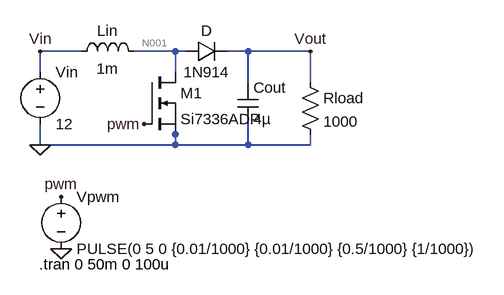
[diagram p0: schematic Buck-Converter.asc]
Buck-Converter.asc, the LTspice schematic file:
Version 4
SHEET 1 916 680
WIRE 128 96 64 96
WIRE 272 96 208 96
WIRE 288 96 272 96
WIRE 384 96 352 96
WIRE 480 96 384 96
WIRE 64 128 64 96
WIRE 272 128 272 96
WIRE 384 144 384 96
WIRE 480 144 480 96
WIRE 272 224 272 208
WIRE 64 240 64 208
WIRE 272 240 272 224
WIRE 272 240 64 240
WIRE 384 240 384 208
WIRE 384 240 272 240
WIRE 480 240 480 224
WIRE 480 240 384 240
FLAG 64 240 0
FLAG 96 400 0
FLAG 96 320 pwm
FLAG 480 96 Vout
FLAG 64 96 Vin
FLAG 224 208 pwm
SYMBOL voltage 64 112 R0
WINDOW 123 0 0 Left 0
WINDOW 39 0 0 Left 0
SYMATTR InstName Vin
SYMATTR Value 12
SYMBOL ind 112 112 R270
WINDOW 0 32 56 VTop 2
WINDOW 3 5 56 VBottom 2
SYMATTR InstName Lin
SYMATTR Value 1m
SYMATTR SpiceLine Rpar=1
SYMBOL cap 368 144 R0
SYMATTR InstName Cout
SYMATTR Value 4µ
SYMATTR SpiceLine Rser=1
SYMBOL res 464 128 R0
SYMATTR InstName Rload
SYMATTR Value 1000
SYMBOL voltage 96 304 R0
WINDOW 123 0 0 Left 0
WINDOW 39 0 0 Left 0
SYMATTR InstName Vpwm
SYMATTR Value PULSE(0 5 0 {0.01/1000} {0.01/1000} {0.5/1000} {1/1000})
SYMBOL nmos 224 128 R0
SYMATTR InstName M1
SYMATTR Value Si7336ADP
SYMBOL diode 288 112 R270
WINDOW 0 32 32 VTop 2
WINDOW 3 0 32 VBottom 2
SYMATTR InstName D
SYMATTR Value 1N914
TEXT 62 424 Left 2 !.tran 0 50m 0 100u

The netlist it stands for:
* Buck-Converter.asc
Vin Vin 0 12
Lin Vin N001 1m Rpar=1
Cout Vout 0 4µ Rser=1
Rload Vout 0 1000
Vpwm pwm 0 PULSE(0 5 0 {0.01/1000} {0.01/1000} {0.5/1000} {1/1000})
M1 N001 pwm 0 0 Si7336ADP
D N001 Vout 1N914
.model D D
.lib standard.dio
.model NMOS NMOS
.model PMOS PMOS
.lib standard.mos
.tran 0 50m 0 100u
.backanno
.end

* Results of the author's LTspice run, read from the files saved beside the schematic
* Operating Point, zero values left out:
*   V(vin) = 12 V
*   V(n001) = 12 V
*   V(vout) = 11.3 V
*   Id(M1) = 17.17 pA
*   Is(M1) = -17.17 pA
*   I(D) = 11.3 mA
*   I(Lin) = 11.3 mA
*   I(Rload) = 11.3 mA
*   I(Vin) = -11.3 mA
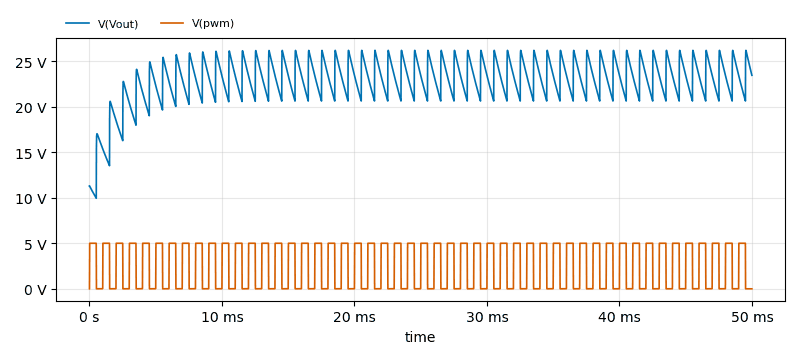
[diagram p1: Transient Analysis of Buck-Converter.asc, plotted from the saved traces]
* Transient Analysis, 1 run:
*   V(Vout): min 9.942 V, max 26.18 V, average 22.86 V, rms 22.99 V, last 23.44 V
*   V(pwm): min 0 V, max 5 V, average 2.55 V, rms 3.559 V, last 0 V